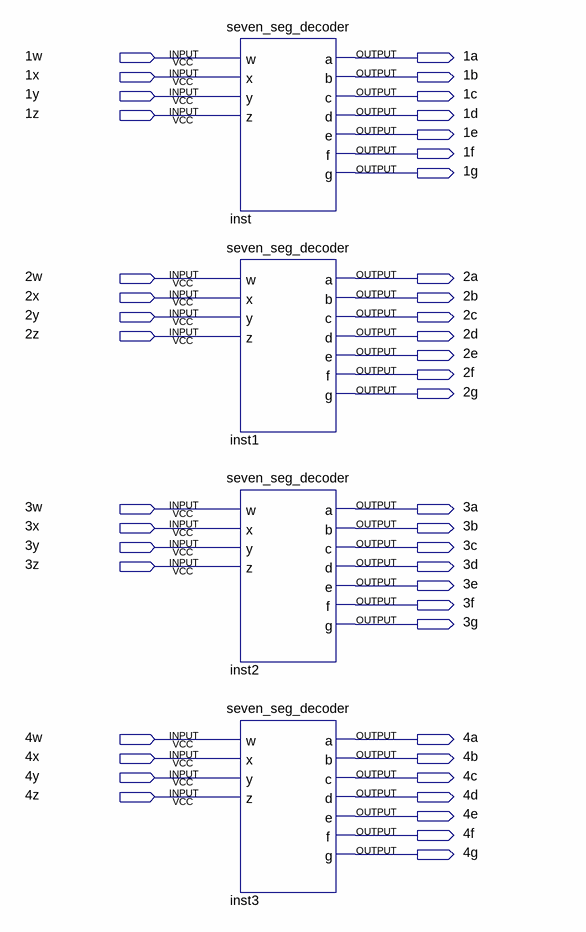
[diagram p0: schematic sheet]
// Quartus schematic lab5step1.bdf as structural Verilog: 4 symbols, 44 pins
module lab5step1 (
  input  \1w ,
  input  \1x ,
  input  \1y ,
  input  \1z ,
  input  \2w ,
  input  \2x ,
  input  \2y ,
  input  \2z ,
  input  \3w ,
  input  \3x ,
  input  \3y ,
  input  \3z ,
  input  \4w ,
  input  \4x ,
  input  \4y ,
  input  \4z ,
  output \1a ,
  output \1b ,
  output \1c ,
  output \1d ,
  output \1e ,
  output \1f ,
  output \1g ,
  output \2a ,
  output \2b ,
  output \2c ,
  output \2d ,
  output \2e ,
  output \2f ,
  output \2g ,
  output \3a ,
  output \3b ,
  output \3c ,
  output \3d ,
  output \3e ,
  output \3f ,
  output \3g ,
  output \4a ,
  output \4b ,
  output \4c ,
  output \4d ,
  output \4e ,
  output \4f ,
  output \4g 
);

  seven_seg_decoder inst (
    .w(\1w ), .x(\1x ), .y(\1y ), .z(\1z ), .a(\1a ), .b(\1b ), .c(\1c ), .d(\1d ), .e(\1e ), .f(\1f ),
    .g(\1g ));
  seven_seg_decoder inst1 (
    .w(\2w ), .x(\2x ), .y(\2y ), .z(\2z ), .a(\2a ), .b(\2b ), .c(\2c ), .d(\2d ), .e(\2e ), .f(\2f ),
    .g(\2g ));
  seven_seg_decoder inst2 (
    .w(\3w ), .x(\3x ), .y(\3y ), .z(\3z ), .a(\3a ), .b(\3b ), .c(\3c ), .d(\3d ), .e(\3e ), .f(\3f ),
    .g(\3g ));
  seven_seg_decoder inst3 (
    .w(\4w ), .x(\4x ), .y(\4y ), .z(\4z ), .a(\4a ), .b(\4b ), .c(\4c ), .d(\4d ), .e(\4e ), .f(\4f ),
    .g(\4g ));
endmodule
